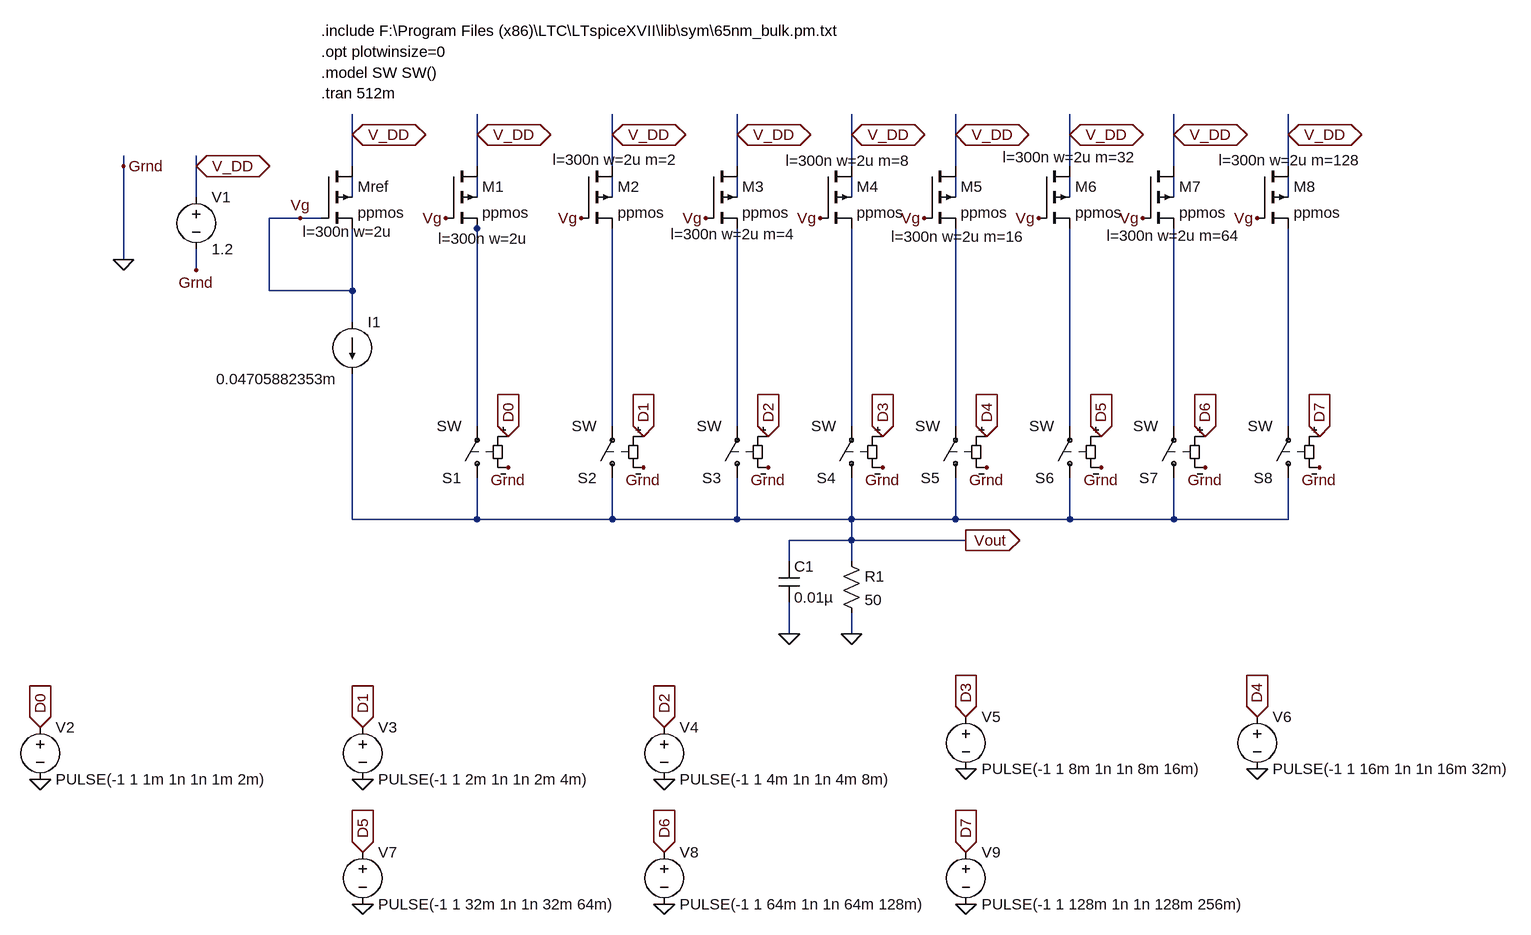
[diagram p0: schematic DAC_Simple_Current_Mirror.asc]
DAC_Simple_Current_Mirror.asc, the LTspice schematic file:
Version 4
SHEET 1 1744 1240
WIRE -64 16 -64 -16
WIRE 128 16 128 -16
WIRE 336 16 336 -16
WIRE 528 16 528 -16
WIRE 704 16 704 -16
WIRE 864 16 864 -16
WIRE 1040 16 1040 -16
WIRE 1200 16 1200 -16
WIRE 1376 16 1376 -16
WIRE -416 64 -416 48
WIRE -304 64 -304 48
WIRE -64 64 -64 16
WIRE 128 64 128 16
WIRE 336 64 336 16
WIRE 528 64 528 16
WIRE 704 64 704 16
WIRE 864 64 864 16
WIRE 1040 64 1040 16
WIRE 1200 64 1200 16
WIRE 1376 64 1376 16
WIRE -304 112 -304 64
WIRE -64 112 -64 80
WIRE 128 112 128 80
WIRE 336 112 336 80
WIRE 528 112 528 80
WIRE 704 112 704 80
WIRE 864 112 864 80
WIRE 1040 112 1040 80
WIRE 1200 112 1200 80
WIRE 1376 112 1376 80
WIRE -144 144 -192 144
WIRE -112 144 -144 144
WIRE 128 160 128 144
WIRE -416 208 -416 64
WIRE -304 224 -304 192
WIRE -192 256 -192 144
WIRE -64 256 -64 160
WIRE -64 256 -192 256
WIRE -64 304 -64 256
WIRE 128 464 128 160
WIRE 336 464 336 160
WIRE 528 464 528 160
WIRE 704 464 704 160
WIRE 864 464 864 160
WIRE 1040 464 1040 160
WIRE 1200 464 1200 160
WIRE 1376 464 1376 160
WIRE -64 608 -64 384
WIRE 128 608 128 544
WIRE 128 608 -64 608
WIRE 336 608 336 544
WIRE 336 608 128 608
WIRE 528 608 528 544
WIRE 528 608 336 608
WIRE 704 608 704 544
WIRE 704 608 528 608
WIRE 864 608 864 544
WIRE 864 608 704 608
WIRE 1040 608 1040 544
WIRE 1040 608 864 608
WIRE 1200 608 1200 544
WIRE 1200 608 1040 608
WIRE 1376 608 1376 544
WIRE 1376 608 1200 608
WIRE 704 640 704 608
WIRE 704 640 608 640
WIRE 880 640 704 640
WIRE 608 672 608 640
WIRE 704 672 704 640
WIRE 608 784 608 736
WIRE 704 784 704 752
FLAG -416 208 0
FLAG -416 64 Grnd
FLAG -304 224 Grnd
FLAG -304 64 V_DD
IOPIN -304 64 BiDir
FLAG -64 16 V_DD
IOPIN -64 16 BiDir
FLAG 128 16 V_DD
IOPIN 128 16 BiDir
FLAG 336 16 V_DD
IOPIN 336 16 BiDir
FLAG 528 16 V_DD
IOPIN 528 16 BiDir
FLAG 704 16 V_DD
IOPIN 704 16 BiDir
FLAG 864 16 V_DD
IOPIN 864 16 BiDir
FLAG 1040 16 V_DD
IOPIN 1040 16 BiDir
FLAG 1200 16 V_DD
IOPIN 1200 16 BiDir
FLAG 1376 16 V_DD
IOPIN 1376 16 BiDir
FLAG 704 784 0
FLAG 608 784 0
FLAG 880 640 Vout
IOPIN 880 640 Out
FLAG 176 528 Grnd
FLAG 384 528 Grnd
FLAG 576 528 Grnd
FLAG 752 528 Grnd
FLAG 912 528 Grnd
FLAG 1088 528 Grnd
FLAG 1248 528 Grnd
FLAG 1424 528 Grnd
FLAG 176 480 D0
IOPIN 176 480 In
FLAG 384 480 D1
IOPIN 384 480 In
FLAG 576 480 D2
IOPIN 576 480 In
FLAG 752 480 D3
IOPIN 752 480 In
FLAG 912 480 D4
IOPIN 912 480 In
FLAG 1088 480 D5
IOPIN 1088 480 In
FLAG 1248 480 D6
IOPIN 1248 480 In
FLAG 1424 480 D7
IOPIN 1424 480 In
FLAG -544 1008 0
FLAG -544 928 D0
IOPIN -544 928 In
FLAG -48 1008 0
FLAG -48 928 D1
IOPIN -48 928 In
FLAG 416 1008 0
FLAG 416 928 D2
IOPIN 416 928 In
FLAG 880 992 0
FLAG 880 912 D3
IOPIN 880 912 In
FLAG 1328 992 0
FLAG 1328 912 D4
IOPIN 1328 912 In
FLAG -48 1200 0
FLAG -48 1120 D5
IOPIN -48 1120 In
FLAG 416 1200 0
FLAG 416 1120 D6
IOPIN 416 1120 In
FLAG 880 1200 0
FLAG 880 1120 D7
IOPIN 880 1120 In
FLAG -144 144 Vg
FLAG 80 144 Vg
FLAG 288 144 Vg
FLAG 480 144 Vg
FLAG 656 144 Vg
FLAG 816 144 Vg
FLAG 992 144 Vg
FLAG 1152 144 Vg
FLAG 1328 144 Vg
SYMBOL voltage -304 96 R0
WINDOW 123 0 0 Left 0
WINDOW 39 0 0 Left 0
SYMATTR InstName V1
SYMATTR Value 1.2
SYMBOL pmos4 -112 64 R0
WINDOW 123 -28 101 Left 2
SYMATTR Value2 l=300n w=2u
SYMATTR InstName Mref
SYMATTR Value ppmos
SYMBOL pmos4 80 64 R0
WINDOW 123 -12 112 Left 2
SYMATTR Value2 l=300n w=2u
SYMATTR InstName M1
SYMATTR Value ppmos
SYMBOL pmos4 288 64 R0
WINDOW 123 -44 -10 Left 2
SYMATTR Value2 l=300n w=2u m=2
SYMATTR InstName M2
SYMATTR Value ppmos
SYMBOL pmos4 480 64 R0
WINDOW 123 -54 105 Left 2
SYMATTR Value2 l=300n w=2u m=4
SYMATTR InstName M3
SYMATTR Value ppmos
SYMBOL pmos4 656 64 R0
WINDOW 123 -53 -8 Left 2
SYMATTR Value2 l=300n w=2u m=8
SYMATTR InstName M4
SYMATTR Value ppmos
SYMBOL pmos4 816 64 R0
WINDOW 123 -51 109 Left 2
SYMATTR Value2 l=300n w=2u m=16
SYMATTR InstName M5
SYMATTR Value ppmos
SYMBOL pmos4 992 64 R0
WINDOW 123 -55 -14 Left 2
SYMATTR Value2 l=300n w=2u m=32
SYMATTR InstName M6
SYMATTR Value ppmos
SYMBOL pmos4 1152 64 R0
WINDOW 123 -55 107 Left 2
SYMATTR Value2 l=300n w=2u m=64
SYMATTR InstName M7
SYMATTR Value ppmos
SYMBOL pmos4 1328 64 R0
WINDOW 123 -59 -9 Left 2
SYMATTR Value2 l=300n w=2u m=128
SYMATTR InstName M8
SYMATTR Value ppmos
SYMBOL current -64 304 R0
WINDOW 3 -209 88 Left 2
WINDOW 123 0 0 Left 0
WINDOW 39 0 0 Left 0
SYMATTR Value 0.04705882353m
SYMATTR InstName I1
SYMBOL res 688 656 R0
SYMATTR InstName R1
SYMATTR Value 50
SYMBOL cap 592 672 R0
SYMATTR InstName C1
SYMATTR Value 0.01µ
SYMBOL sw 128 560 R180
SYMATTR InstName S1
SYMBOL sw 336 560 R180
SYMATTR InstName S2
SYMBOL sw 528 560 R180
SYMATTR InstName S3
SYMBOL sw 704 560 R180
SYMATTR InstName S4
SYMBOL sw 864 560 R180
SYMATTR InstName S5
SYMBOL sw 1040 560 R180
SYMATTR InstName S6
SYMBOL sw 1200 560 R180
SYMATTR InstName S7
SYMBOL sw 1376 560 R180
SYMATTR InstName S8
SYMBOL voltage -544 912 R0
WINDOW 123 0 0 Left 0
WINDOW 39 0 0 Left 0
SYMATTR InstName V2
SYMATTR Value PULSE(-1 1 1m 1n 1n 1m 2m)
SYMBOL voltage -48 912 R0
WINDOW 123 0 0 Left 0
WINDOW 39 0 0 Left 0
SYMATTR InstName V3
SYMATTR Value PULSE(-1 1 2m 1n 1n 2m 4m)
SYMBOL voltage 416 912 R0
WINDOW 123 0 0 Left 0
WINDOW 39 0 0 Left 0
SYMATTR InstName V4
SYMATTR Value PULSE(-1 1 4m 1n 1n 4m 8m)
SYMBOL voltage 880 896 R0
WINDOW 123 0 0 Left 0
WINDOW 39 0 0 Left 0
SYMATTR InstName V5
SYMATTR Value PULSE(-1 1 8m 1n 1n 8m 16m)
SYMBOL voltage 1328 896 R0
WINDOW 123 0 0 Left 0
WINDOW 39 0 0 Left 0
SYMATTR InstName V6
SYMATTR Value PULSE(-1 1 16m 1n 1n 16m 32m)
SYMBOL voltage -48 1104 R0
WINDOW 123 0 0 Left 0
WINDOW 39 0 0 Left 0
SYMATTR InstName V7
SYMATTR Value PULSE(-1 1 32m 1n 1n 32m 64m)
SYMBOL voltage 416 1104 R0
WINDOW 123 0 0 Left 0
WINDOW 39 0 0 Left 0
SYMATTR InstName V8
SYMATTR Value PULSE(-1 1 64m 1n 1n 64m 128m)
SYMBOL voltage 880 1104 R0
WINDOW 123 0 0 Left 0
WINDOW 39 0 0 Left 0
SYMATTR InstName V9
SYMATTR Value PULSE(-1 1 128m 1n 1n 128m 256m)
TEXT -112 -144 Left 2 !.include F:\\Program Files (x86)\\LTC\\LTspiceXVII\\lib\\sym\\65nm_bulk.pm.txt
TEXT -112 -112 Left 2 !.opt plotwinsize=0
TEXT -112 -80 Left 2 !.model SW SW()
TEXT -112 -48 Left 2 !.tran 512m

The netlist it stands for:
* DAC_Simple_Current_Mirror.asc
V1 V_DD 0 1.2
Mref V_DD Vg Vg N001 ppmos l=300n w=2u
M1 V_DD Vg N010 N002 ppmos l=300n w=2u
M2 V_DD Vg N011 N003 ppmos l=300n w=2u m=2
M3 V_DD Vg N012 N004 ppmos l=300n w=2u m=4
M4 V_DD Vg N013 N005 ppmos l=300n w=2u m=8
M5 V_DD Vg N014 N006 ppmos l=300n w=2u m=16
M6 V_DD Vg N015 N007 ppmos l=300n w=2u m=32
M7 V_DD Vg N016 N008 ppmos l=300n w=2u m=64
M8 V_DD Vg N017 N009 ppmos l=300n w=2u m=128
I1 Vg Vout 0.04705882353m
R1 Vout 0 50
C1 Vout 0 0.01µ
S1 Vout N010 D0 0 SW
S2 Vout N011 D1 0 SW
S3 Vout N012 D2 0 SW
S4 Vout N013 D3 0 SW
S5 Vout N014 D4 0 SW
S6 Vout N015 D5 0 SW
S7 Vout N016 D6 0 SW
S8 Vout N017 D7 0 SW
V2 D0 0 PULSE(-1 1 1m 1n 1n 1m 2m)
V3 D1 0 PULSE(-1 1 2m 1n 1n 2m 4m)
V4 D2 0 PULSE(-1 1 4m 1n 1n 4m 8m)
V5 D3 0 PULSE(-1 1 8m 1n 1n 8m 16m)
V6 D4 0 PULSE(-1 1 16m 1n 1n 16m 32m)
V7 D5 0 PULSE(-1 1 32m 1n 1n 32m 64m)
V8 D6 0 PULSE(-1 1 64m 1n 1n 64m 128m)
V9 D7 0 PULSE(-1 1 128m 1n 1n 128m 256m)
.model NMOS NMOS
.model PMOS PMOS
.lib standard.mos
.include F:\Program Files (x86)\LTC\LTspiceXVII\lib\sym\65nm_bulk.pm.txt
.opt plotwinsize=0
.model SW SW()
.tran 512m
.backanno
.end